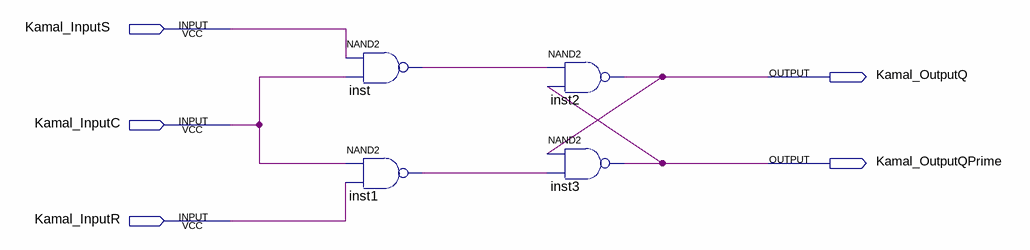
[diagram p0: schematic sheet]
// Quartus schematic Kamal_Faheem_ControlSRLatch.bdf as structural Verilog: 4 symbols, 5 pins
module Kamal_Faheem_ControlSRLatch (
  input  Kamal_InputS,
  input  Kamal_InputC,
  input  Kamal_InputR,
  output Kamal_OutputQ,
  output Kamal_OutputQPrime
);

  wire inst1_out, inst_out;

  nand inst (inst_out, Kamal_InputS, Kamal_InputC);
  nand inst1 (inst1_out, Kamal_InputC, Kamal_InputR);
  nand inst2 (Kamal_OutputQ, inst_out, Kamal_OutputQPrime);
  nand inst3 (Kamal_OutputQPrime, Kamal_OutputQ, inst1_out);
endmodule
